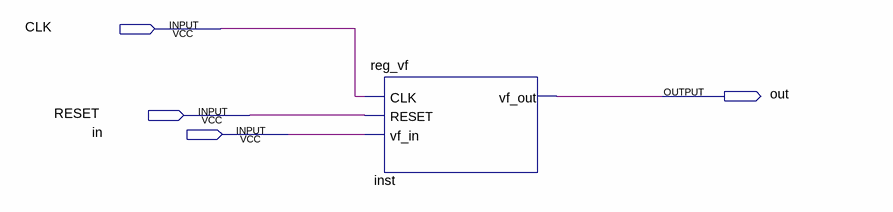
[diagram p0: schematic sheet]
// Quartus schematic registrosmemoria.bdf as structural Verilog: 1 symbols, 4 pins
module registrosmemoria (
  input  CLK,
  input  RESET,
  input  in,
  output out
);

  reg_vf inst (.CLK(CLK), .RESET(RESET), .vf_in(in), .vf_out(out));
endmodule
